# Altium schematic sheet KeyboardMoudle1.SchDoc
size A4
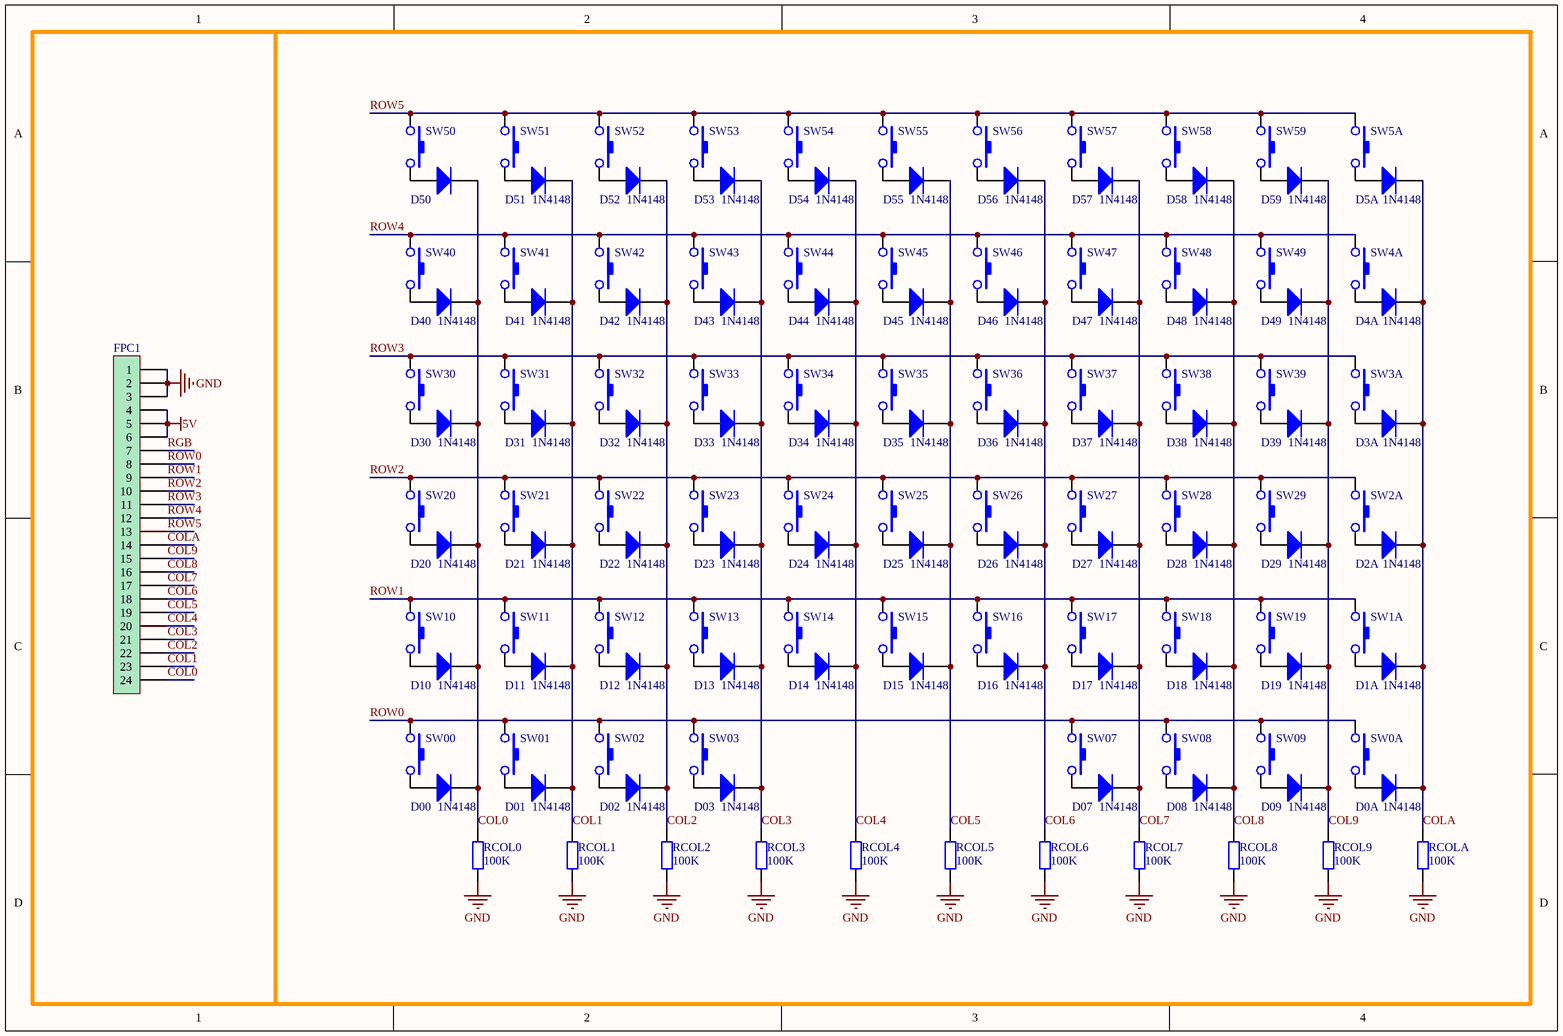
[diagram p0: KeyboardMoudle1.SchDoc]

## Parts
D00  1N4148  [SOD523]
D0A  1N4148  [SOD523]
D01  1N4148  [SOD523]
D1A  1N4148  [SOD523]
D02  1N4148  [SOD523]
D2A  1N4148  [SOD523]
D03  1N4148  [SOD523]
D3A  1N4148  [SOD523]
D4A  1N4148  [SOD523]
D5A  1N4148  [SOD523]
D07  1N4148  [SOD523]
D08  1N4148  [SOD523]
D09  1N4148  [SOD523]
D10  1N4148  [SOD523]
D11  1N4148  [SOD523]
D12  1N4148  [SOD523]
D13  1N4148  [SOD523]
D14  1N4148  [SOD523]
D15  1N4148  [SOD523]
D16  1N4148  [SOD523]
D17  1N4148  [SOD523]
D18  1N4148  [SOD523]
D19  1N4148  [SOD523]
D20  1N4148  [SOD523]
D21  1N4148  [SOD523]
D22  1N4148  [SOD523]
D23  1N4148  [SOD523]
D24  1N4148  [SOD523]
D25  1N4148  [SOD523]
D26  1N4148  [SOD523]
D27  1N4148  [SOD523]
D28  1N4148  [SOD523]
D29  1N4148  [SOD523]
D30  1N4148  [SOD523]
D31  1N4148  [SOD523]
D32  1N4148  [SOD523]
D33  1N4148  [SOD523]
D34  1N4148  [SOD523]
D35  1N4148  [SOD523]
D36  1N4148  [SOD523]
D37  1N4148  [SOD523]
D38  1N4148  [SOD523]
D39  1N4148  [SOD523]
D40  1N4148  [SOD523]
D41  1N4148  [SOD523]
D42  1N4148  [SOD523]
D43  1N4148  [SOD523]
D44  1N4148  [SOD523]
D45  1N4148  [SOD523]
D46  1N4148  [SOD523]
D47  1N4148  [SOD523]
D48  1N4148  [SOD523]
D49  1N4148  [SOD523]
D50  (no value)  [SOD523]
D51  1N4148  [SOD523]
D52  1N4148  [SOD523]
D53  1N4148  [SOD523]
D54  1N4148  [SOD523]
D55  1N4148  [SOD523]
D56  1N4148  [SOD523]
D57  1N4148  [SOD523]
D58  1N4148  [SOD523]
D59  1N4148  [SOD523]
FPC1  FPC_0.5_24P  [FPC_0.5_24PIN]  (value not drawn)
RCOL0  100K  [R_0603]
RCOL1  100K  [R_0603]
RCOL2  100K  [R_0603]
RCOL3  100K  [R_0603]
RCOL4  100K  [R_0603]
RCOL5  100K  [R_0603]
RCOL6  100K  [R_0603]
RCOL7  100K  [R_0603]
RCOL8  100K  [R_0603]
RCOL9  100K  [R_0603]
RCOLA  100K  [R_0603]
SW00  KAILH  [KAILH_1350_HOTSWAP]  (value not drawn)
SW0A  KAILH  [KAILH_1350_HOTSWAP]  (value not drawn)
SW01  KAILH  [KAILH_1350_HOTSWAP]  (value not drawn)
SW1A  KAILH  [KAILH_1350_HOTSWAP]  (value not drawn)
SW02  KAILH  [KAILH_1350_HOTSWAP]  (value not drawn)
SW2A  KAILH  [KAILH_1350_HOTSWAP]  (value not drawn)
SW03  KAILH  [KAILH_1350_HOTSWAP]  (value not drawn)
SW3A  KAILH  [KAILH_1350_HOTSWAP]  (value not drawn)
SW4A  KAILH  [KAILH_1350_HOTSWAP]  (value not drawn)
SW5A  KAILH  [KAILH_1350_HOTSWAP]  (value not drawn)
SW07  KAILH  [KAILH_1350_HOTSWAP]  (value not drawn)
SW08  KAILH  [KAILH_1350_HOTSWAP]  (value not drawn)
SW09  KAILH  [KAILH_1350_HOTSWAP]  (value not drawn)
SW10  KAILH  [KAILH_1350_HOTSWAP]  (value not drawn)
SW11  KAILH  [KAILH_1350_HOTSWAP]  (value not drawn)
SW12  KAILH  [KAILH_1350_HOTSWAP]  (value not drawn)
SW13  KAILH  [KAILH_1350_HOTSWAP]  (value not drawn)
SW14  KAILH  [KAILH_1350_HOTSWAP]  (value not drawn)
SW15  KAILH  [KAILH_1350_HOTSWAP]  (value not drawn)
SW16  KAILH  [KAILH_1350_HOTSWAP]  (value not drawn)
SW17  KAILH  [KAILH_1350_HOTSWAP]  (value not drawn)
SW18  KAILH  [KAILH_1350_HOTSWAP]  (value not drawn)
SW19  KAILH  [KAILH_1350_HOTSWAP]  (value not drawn)
SW20  KAILH  [KAILH_1350_HOTSWAP]  (value not drawn)
SW21  KAILH  [KAILH_1350_HOTSWAP]  (value not drawn)
SW22  KAILH  [KAILH_1350_HOTSWAP]  (value not drawn)
SW23  KAILH  [KAILH_1350_HOTSWAP]  (value not drawn)
SW24  KAILH  [KAILH_1350_HOTSWAP]  (value not drawn)
SW25  KAILH  [KAILH_1350_HOTSWAP]  (value not drawn)
SW26  KAILH  [KAILH_1350_HOTSWAP]  (value not drawn)
SW27  KAILH  [KAILH_1350_HOTSWAP]  (value not drawn)
SW28  KAILH  [KAILH_1350_HOTSWAP]  (value not drawn)
SW29  KAILH  [KAILH_1350_HOTSWAP]  (value not drawn)
SW30  KAILH  [KAILH_1350_HOTSWAP]  (value not drawn)
SW31  KAILH  [KAILH_1350_HOTSWAP]  (value not drawn)
SW32  KAILH  [KAILH_1350_HOTSWAP]  (value not drawn)
SW33  KAILH  [KAILH_1350_HOTSWAP]  (value not drawn)
SW34  KAILH  [KAILH_1350_HOTSWAP]  (value not drawn)
SW35  KAILH  [KAILH_1350_HOTSWAP]  (value not drawn)
SW36  KAILH  [KAILH_1350_HOTSWAP]  (value not drawn)
SW37  KAILH  [KAILH_1350_HOTSWAP]  (value not drawn)
SW38  KAILH  [KAILH_1350_HOTSWAP]  (value not drawn)
SW39  KAILH  [KAILH_1350_HOTSWAP]  (value not drawn)
SW40  KAILH  [KAILH_1350_HOTSWAP]  (value not drawn)
SW41  KAILH  [KAILH_1350_HOTSWAP]  (value not drawn)
SW42  KAILH  [KAILH_1350_HOTSWAP]  (value not drawn)
SW43  KAILH  [KAILH_1350_HOTSWAP]  (value not drawn)
SW44  KAILH  [KAILH_1350_HOTSWAP]  (value not drawn)
SW45  KAILH  [KAILH_1350_HOTSWAP]  (value not drawn)
SW46  KAILH  [KAILH_1350_HOTSWAP]  (value not drawn)
SW47  KAILH  [KAILH_1350_HOTSWAP]  (value not drawn)
SW48  KAILH  [KAILH_1350_HOTSWAP]  (value not drawn)
SW49  KAILH  [KAILH_1350_HOTSWAP]  (value not drawn)
SW50  KAILH  [KAILH_1350_HOTSWAP]  (value not drawn)
SW51  KAILH  [KAILH_1350_HOTSWAP]  (value not drawn)
SW52  KAILH  [KAILH_1350_HOTSWAP]  (value not drawn)
SW53  KAILH  [KAILH_1350_HOTSWAP]  (value not drawn)
SW54  KAILH  [KAILH_1350_HOTSWAP]  (value not drawn)
SW55  KAILH  [KAILH_1350_HOTSWAP]  (value not drawn)
SW56  KAILH  [KAILH_1350_HOTSWAP]  (value not drawn)
SW57  KAILH  [KAILH_1350_HOTSWAP]  (value not drawn)
SW58  KAILH  [KAILH_1350_HOTSWAP]  (value not drawn)
SW59  KAILH  [KAILH_1350_HOTSWAP]  (value not drawn)

## Nets
5V: FPC1.4 FPC1.5 FPC1.6
GND: FPC1.1 FPC1.2 FPC1.3 RCOL0.1 RCOL1.1 RCOL2.1 RCOL3.1 RCOL4.1 RCOL5.1 RCOL6.1 RCOL7.1 RCOL8.1 RCOL9.1 RCOLA.1
COL0: D00.2(K) D10.2(K) D20.2(K) D30.2(K) D40.2(K) D50.2(K) FPC1.24 RCOL0.2
COL1: D01.2(K) D11.2(K) D21.2(K) D31.2(K) D41.2(K) D51.2(K) FPC1.23 RCOL1.2
COL2: D02.2(K) D12.2(K) D22.2(K) D32.2(K) D42.2(K) D52.2(K) FPC1.22 RCOL2.2
COL3: D03.2(K) D13.2(K) D23.2(K) D33.2(K) D43.2(K) D53.2(K) FPC1.21 RCOL3.2
COL4: D14.2(K) D24.2(K) D34.2(K) D44.2(K) D54.2(K) FPC1.20 RCOL4.2
COL5: D15.2(K) D25.2(K) D35.2(K) D45.2(K) D55.2(K) FPC1.19 RCOL5.2
COL6: D16.2(K) D26.2(K) D36.2(K) D46.2(K) D56.2(K) FPC1.18 RCOL6.2
COL7: D07.2(K) D17.2(K) D27.2(K) D37.2(K) D47.2(K) D57.2(K) FPC1.17 RCOL7.2
COL8: D08.2(K) D18.2(K) D28.2(K) D38.2(K) D48.2(K) D58.2(K) FPC1.16 RCOL8.2
COL9: D09.2(K) D19.2(K) D29.2(K) D39.2(K) D49.2(K) D59.2(K) FPC1.15 RCOL9.2
COLA: D0A.2(K) D1A.2(K) D2A.2(K) D3A.2(K) D4A.2(K) D5A.2(K) FPC1.14 RCOLA.2
RGB: FPC1.7
ROW0: FPC1.8 SW00.1 SW0A.1 SW01.1 SW02.1 SW03.1 SW07.1 SW08.1 SW09.1
ROW1: FPC1.9 SW1A.1 SW10.1 SW11.1 SW12.1 SW13.1 SW14.1 SW15.1 SW16.1 SW17.1 SW18.1 SW19.1
ROW2: FPC1.10 SW2A.1 SW20.1 SW21.1 SW22.1 SW23.1 SW24.1 SW25.1 SW26.1 SW27.1 SW28.1 SW29.1
ROW3: FPC1.11 SW3A.1 SW30.1 SW31.1 SW32.1 SW33.1 SW34.1 SW35.1 SW36.1 SW37.1 SW38.1 SW39.1
ROW4: FPC1.12 SW4A.1 SW40.1 SW41.1 SW42.1 SW43.1 SW44.1 SW45.1 SW46.1 SW47.1 SW48.1 SW49.1
ROW5: FPC1.13 SW5A.1 SW50.1 SW51.1 SW52.1 SW53.1 SW54.1 SW55.1 SW56.1 SW57.1 SW58.1 SW59.1
NetD00_1: D00.1(A) SW00.2
NetD0A_1: D0A.1(A) SW0A.2
NetD01_1: D01.1(A) SW01.2
NetD1A_1: D1A.1(A) SW1A.2
NetD02_1: D02.1(A) SW02.2
NetD2A_1: D2A.1(A) SW2A.2
NetD03_1: D03.1(A) SW03.2
NetD3A_1: D3A.1(A) SW3A.2
NetD4A_1: D4A.1(A) SW4A.2
NetD5A_1: D5A.1(A) SW5A.2
NetD07_1: D07.1(A) SW07.2
NetD08_1: D08.1(A) SW08.2
NetD09_1: D09.1(A) SW09.2
NetD10_1: D10.1(A) SW10.2
NetD11_1: D11.1(A) SW11.2
NetD12_1: D12.1(A) SW12.2
NetD13_1: D13.1(A) SW13.2
NetD14_1: D14.1(A) SW14.2
NetD15_1: D15.1(A) SW15.2
NetD16_1: D16.1(A) SW16.2
NetD17_1: D17.1(A) SW17.2
NetD18_1: D18.1(A) SW18.2
NetD19_1: D19.1(A) SW19.2
NetD20_1: D20.1(A) SW20.2
NetD21_1: D21.1(A) SW21.2
NetD22_1: D22.1(A) SW22.2
NetD23_1: D23.1(A) SW23.2
NetD24_1: D24.1(A) SW24.2
NetD25_1: D25.1(A) SW25.2
NetD26_1: D26.1(A) SW26.2
NetD27_1: D27.1(A) SW27.2
NetD28_1: D28.1(A) SW28.2
NetD29_1: D29.1(A) SW29.2
NetD30_1: D30.1(A) SW30.2
NetD31_1: D31.1(A) SW31.2
NetD32_1: D32.1(A) SW32.2
NetD33_1: D33.1(A) SW33.2
NetD34_1: D34.1(A) SW34.2
NetD35_1: D35.1(A) SW35.2
NetD36_1: D36.1(A) SW36.2
NetD37_1: D37.1(A) SW37.2
NetD38_1: D38.1(A) SW38.2
NetD39_1: D39.1(A) SW39.2
NetD40_1: D40.1(A) SW40.2
NetD41_1: D41.1(A) SW41.2
NetD42_1: D42.1(A) SW42.2
NetD43_1: D43.1(A) SW43.2
NetD44_1: D44.1(A) SW44.2
NetD45_1: D45.1(A) SW45.2
NetD46_1: D46.1(A) SW46.2
NetD47_1: D47.1(A) SW47.2
NetD48_1: D48.1(A) SW48.2
NetD49_1: D49.1(A) SW49.2
NetD50_1: D50.1(A) SW50.2
NetD51_1: D51.1(A) SW51.2
NetD52_1: D52.1(A) SW52.2
NetD53_1: D53.1(A) SW53.2
NetD54_1: D54.1(A) SW54.2
NetD55_1: D55.1(A) SW55.2
NetD56_1: D56.1(A) SW56.2
NetD57_1: D57.1(A) SW57.2
NetD58_1: D58.1(A) SW58.2
NetD59_1: D59.1(A) SW59.2

## Library data of the parts
D00 D0A D01 D1A D02 D2A D03 D3A D4A D5A D07 D08 D09-D59 = DIO_1N4148_SOD523: 开关二极管
FPC1 = FPC_0.5_24P: FPC 0.5 24Pin
RCOL0-RCOL9 RCOLA = RES_0603: 电阻 0603
SW00 SW0A SW01 SW1A SW02 SW2A SW03 SW3A SW4A SW5A SW07 SW08 SW09-SW59 = SWITCH_KAILH_1350: 凯华机械矮轴1350用热插拔轴座